# EAGLE design v2.1 (EAGLE 9.1.2)
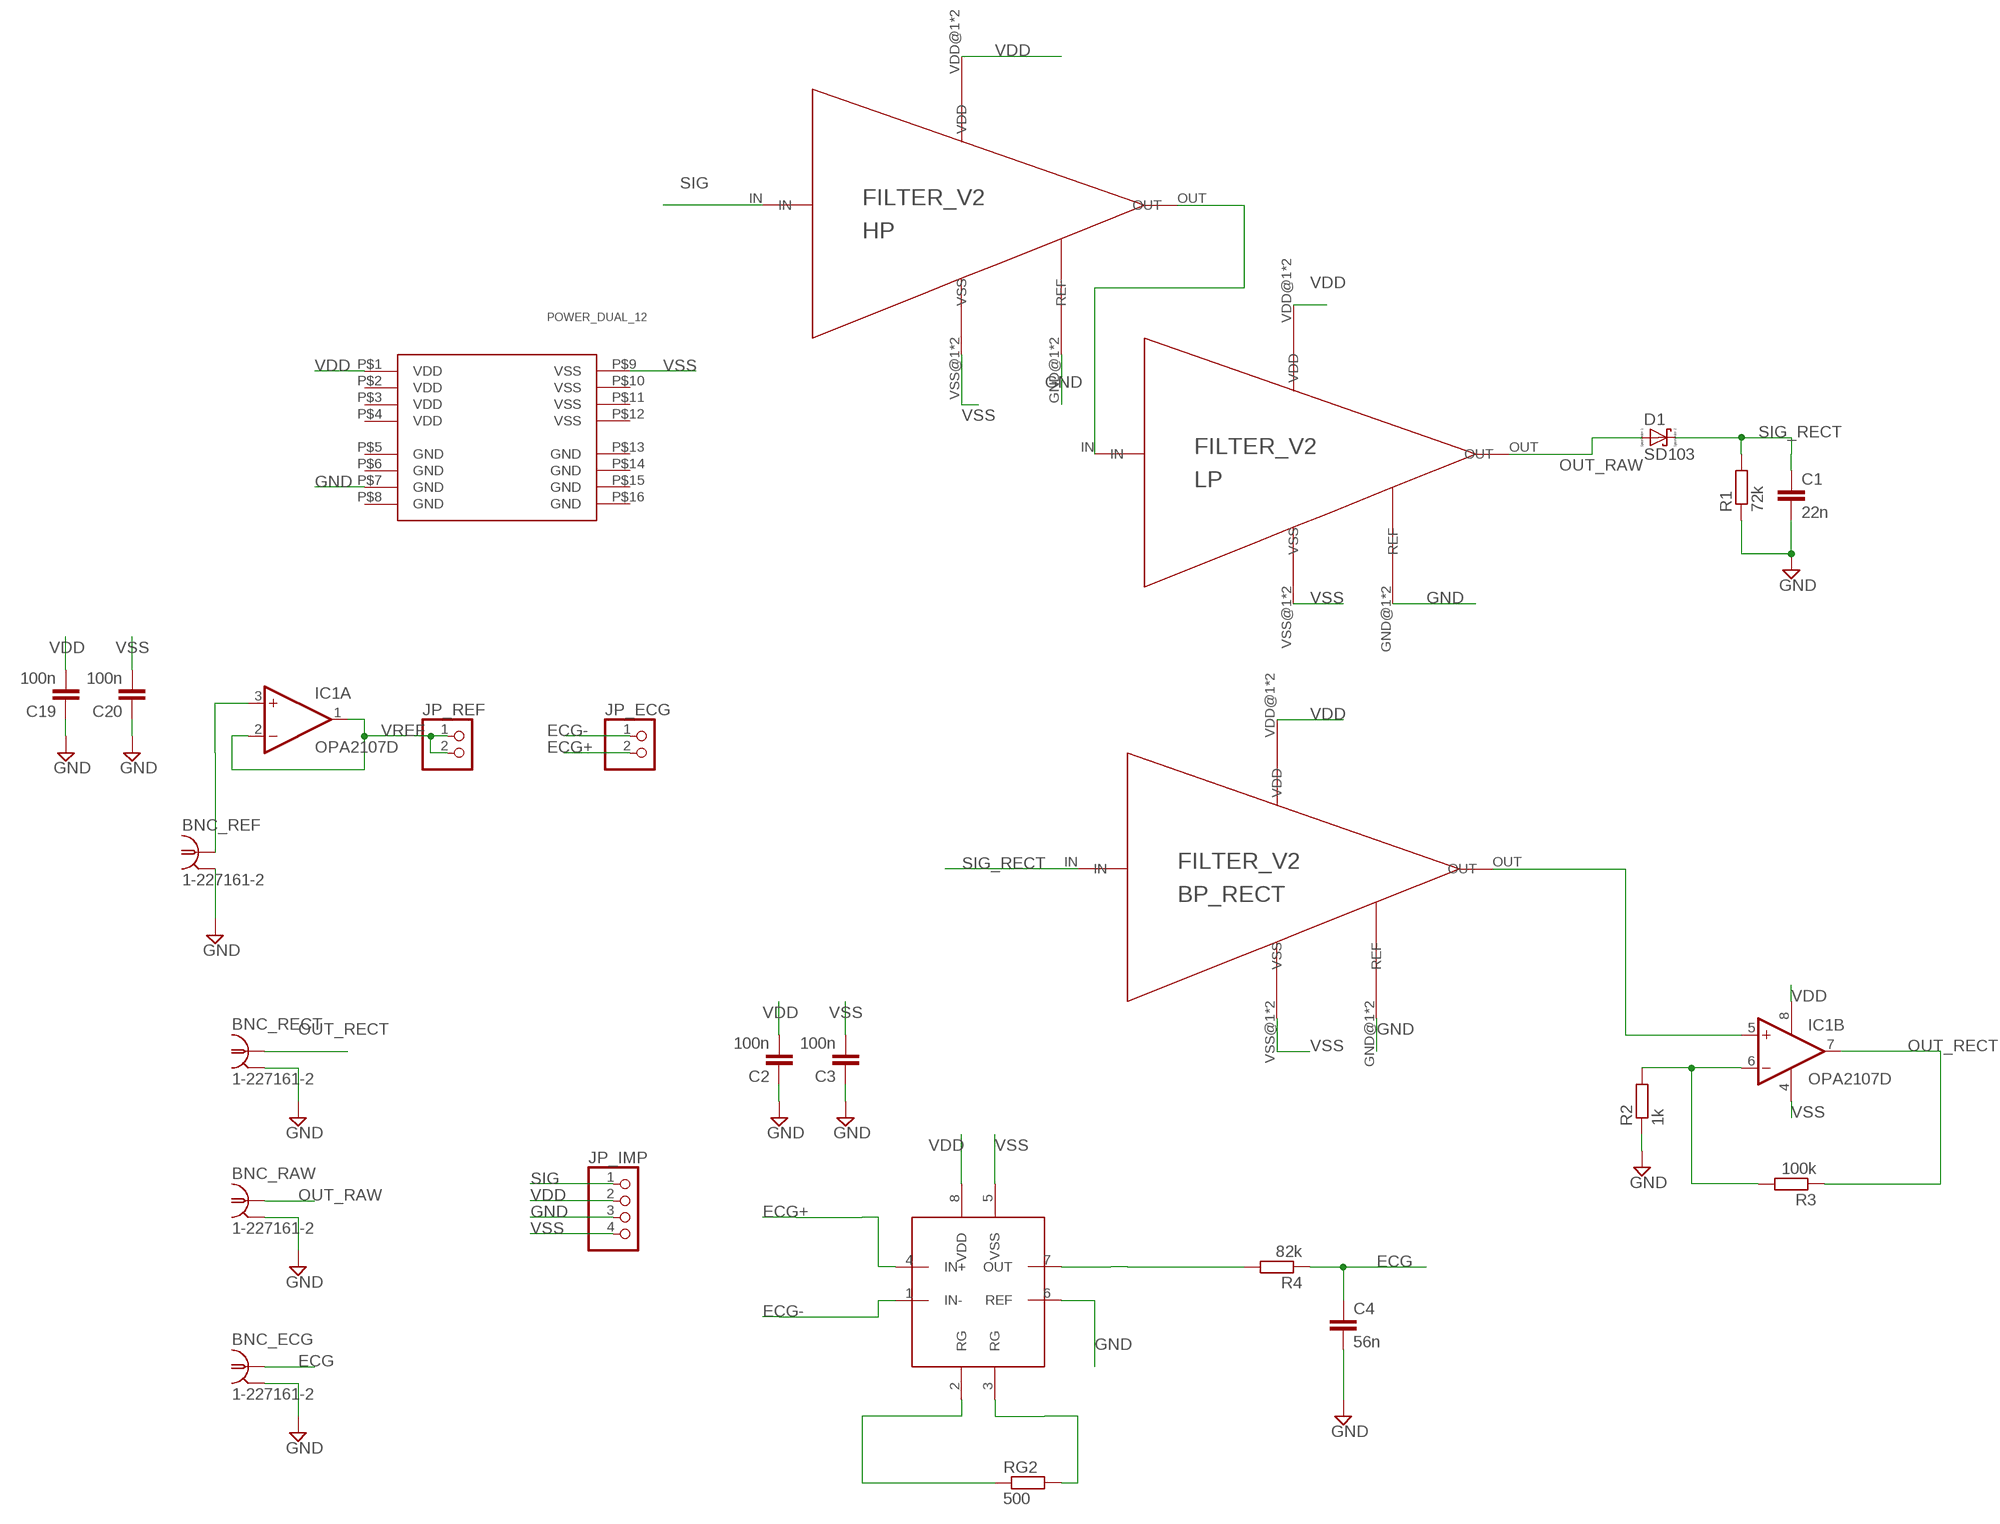
[diagram p0: schematic, sheet 1]

## Parts
BNC_ECG  1-227161-2  [AMP_227161]
BNC_RAW  1-227161-2  [AMP_227161]
BNC_RECT  1-227161-2  [AMP_227161]
BNC_REF  1-227161-2  [AMP_227161]
BP_RECT  FILTER_V2  [MODULE_FILTER_V2]
C1  22n  C-EUC0805  [C0805]
C2  100n  C-EUC0805  [C0805]
C3  100n  C-EUC0805  [C0805]
C4  56n  C-EUC0805  [C0805]
C19  100n  C-EUC0805  [C0805]
C20  100n  C-EUC0805  [C0805]
D1  SD103  SCHOTTKY-DIODE  [DIODE_SMB]
HP  FILTER_V2  [MODULE_FILTER_V2]
IC1  OPA2107D  [SO08]
INA  AD8429  [SO8]
JP_ECG  PINHD-1X2  [1X02]
JP_IMP  PINHD-1X4  [1X04]
JP_REF  PINHD-1X2  [1X02]
LP  FILTER_V2  [MODULE_FILTER_V2]
R1  72k  R-EU_R0805  [R0805]
R2  1k  R-EU_R0805  [R0805]
R3  100k  R-EU_R0805  [R0805]
R4  82k  R-EU_R0805  [R0805]
RG2  500  R-EU_R0805  [R0805]
U$1  POWER_DUAL_12  [MODULE_4X8]

## Nets
ECG: BNC_ECG.1 C4.1 R4.1
ECG+: INA.4(IN+) JP_ECG.2
ECG-: INA.1(IN-) JP_ECG.1
GND: BNC_ECG.2 BNC_RAW.2 BNC_RECT.2 BNC_REF.2 BP_RECT.GND@1(REF) BP_RECT.GND@2(REF) C1.2 C2.1 C3.1 C4.2 C19.1 C20.1 HP.GND@1(REF) HP.GND@2(REF) INA.6(REF) JP_IMP.3 LP.GND@1(REF) LP.GND@2(REF) R1.1 R2.1 U$1.P$7(GND)
N$1: IC1.6(B:-IN) R2.2 R3.2
N$2: BP_RECT.OUT IC1.5(B:+IN)
N$3: INA.7(OUT) R4.2
N$4: HP.OUT LP.IN
N$7: BNC_REF.1 IC1.3(A:+IN)
N$15: INA.2(RG) RG2.1
N$16: INA.3(RG) RG2.2
OUT_RAW: BNC_RAW.1 D1.A(C) LP.OUT
OUT_RECT: BNC_RECT.1 IC1.7(B:OUT) R3.1
SIG: HP.IN JP_IMP.1
SIG_RECT: BP_RECT.IN C1.1 D1.C(A) R1.2
VDD: BP_RECT.VDD@1(VDD) BP_RECT.VDD@2(VDD) C2.2 C19.2 HP.VDD@1(VDD) HP.VDD@2(VDD) IC1.8(P:V+) INA.8(VDD) JP_IMP.2 LP.VDD@1(VDD) LP.VDD@2(VDD) U$1.P$1(VDD)
VREF: IC1.1(A:OUT) IC1.2(A:-IN) JP_REF.1 JP_REF.2
VSS: BP_RECT.VSS@1(VSS) BP_RECT.VSS@2(VSS) C3.2 C20.2 HP.VSS@1(VSS) HP.VSS@2(VSS) IC1.4(P:V-) INA.5(VSS) JP_IMP.4 LP.VSS@1(VSS) LP.VSS@2(VSS) U$1.P$9(VSS)
Unconnected: U$1.P$2(VDD) U$1.P$3(VDD) U$1.P$4(VDD) U$1.P$5(GND) U$1.P$6(GND) U$1.P$8(GND) U$1.P$10(VSS) U$1.P$11(VSS) U$1.P$12(VSS) U$1.P$13(GND) U$1.P$14(GND) U$1.P$15(GND) U$1.P$16(GND)

## Library data of the parts
BNC_ECG BNC_RAW BNC_RECT BNC_REF = con-coax:?227161*: JACK, RIGHT ANGLE, 50 OHM, PCB, BNC Source: amp_227161.pdf; OC_FARNELL: unknown; OC_NEWARK: unknown
BP_RECT HP LP = uguz_cEGG:FILTER_V2
C1 C4 = rcl:C-EU: CAPACITOR, European symbol; SPICEPREFIX: C
C2 C3 C19 C20 = resistor:C-EU: CAPACITOR, European symbol
D1 = eagle-ltspice:SCHOTTKY-DIODE: Schottky Diode; SPICEMODEL: NONE; SPICEPREFIX: D; SPICETYPE: diode
IC1 = linear:OPA2107: OP AMP
INA = uguz_cEGG:AD8429: AD8429 Low Noise Instrumentation Amplifier https://www.mouser.de/datasheet/2/609/AD8429-1502266.pdf
JP_ECG JP_REF = pinhead:PINHD-1X2: PIN HEADER
JP_IMP = pinhead:PINHD-1X4: PIN HEADER
R1-R4 RG2 = rcl:R-EU_: RESISTOR, European symbol; SPICEPREFIX: R
U$1 = uguz_cEGG:POWER_DUAL_12

## Board
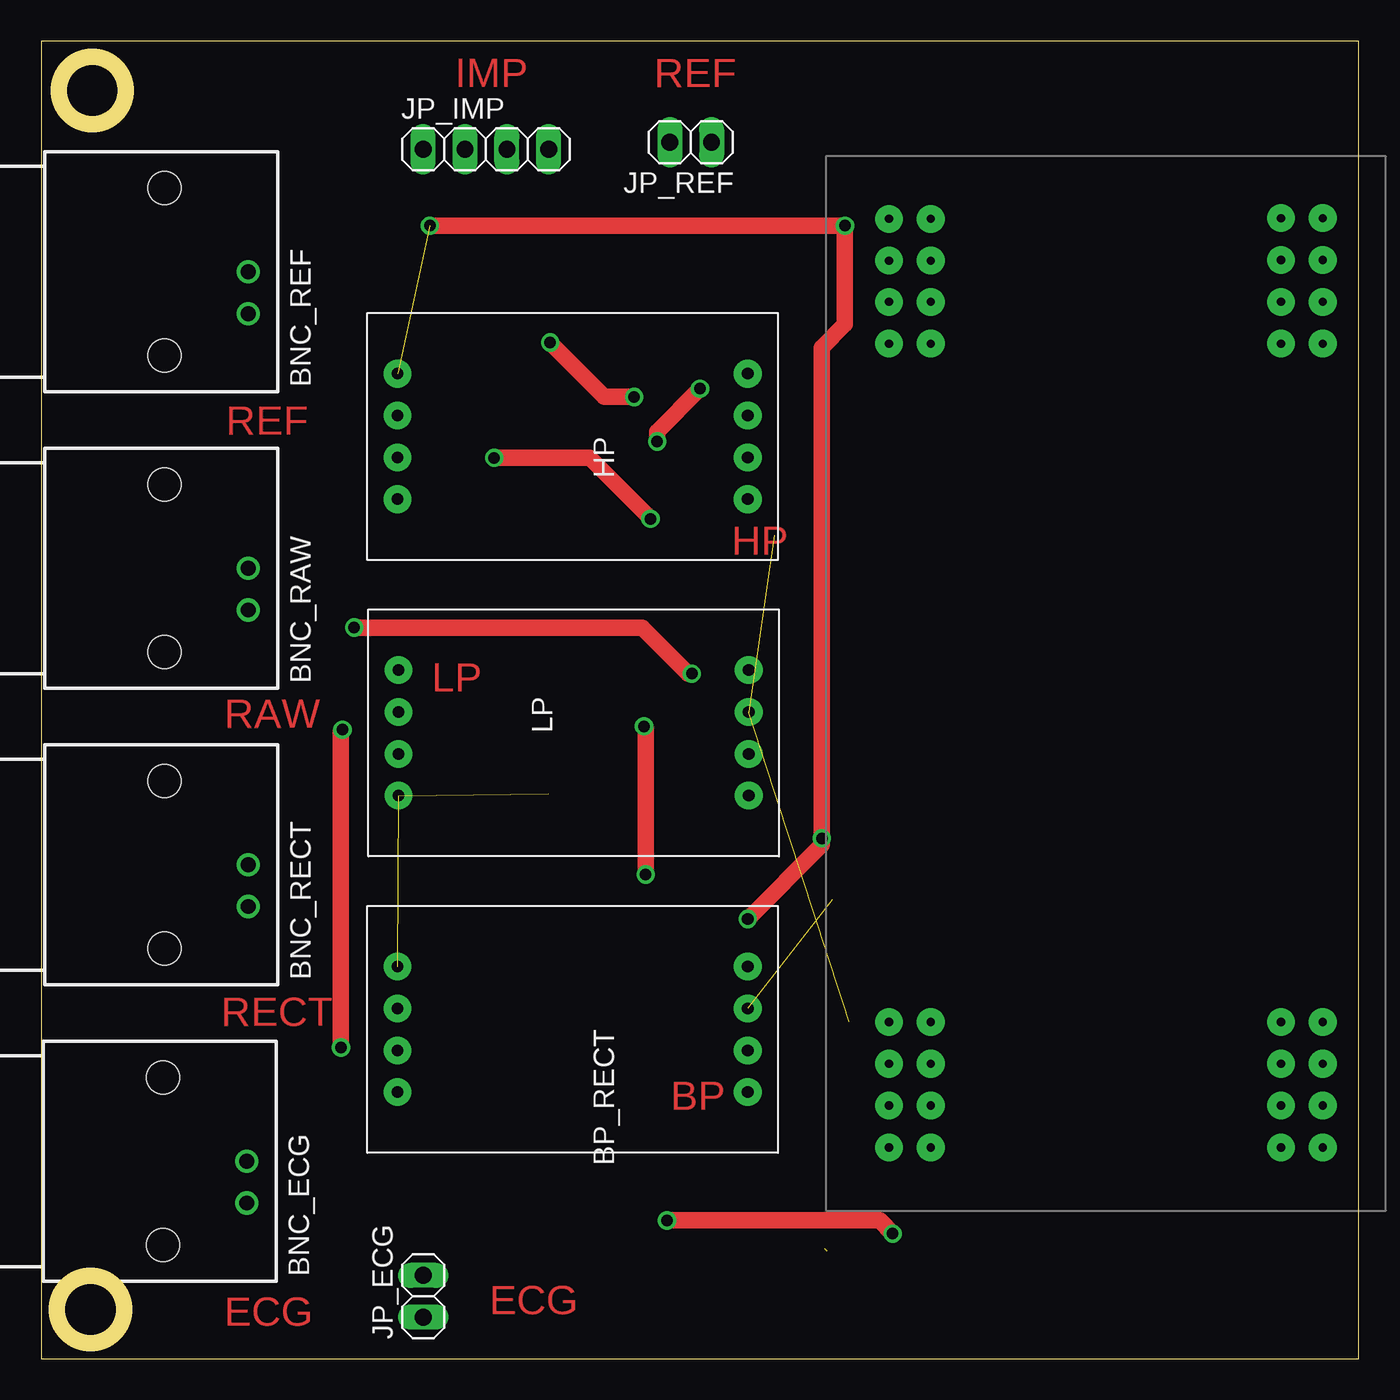
[diagram p1: board, top side]
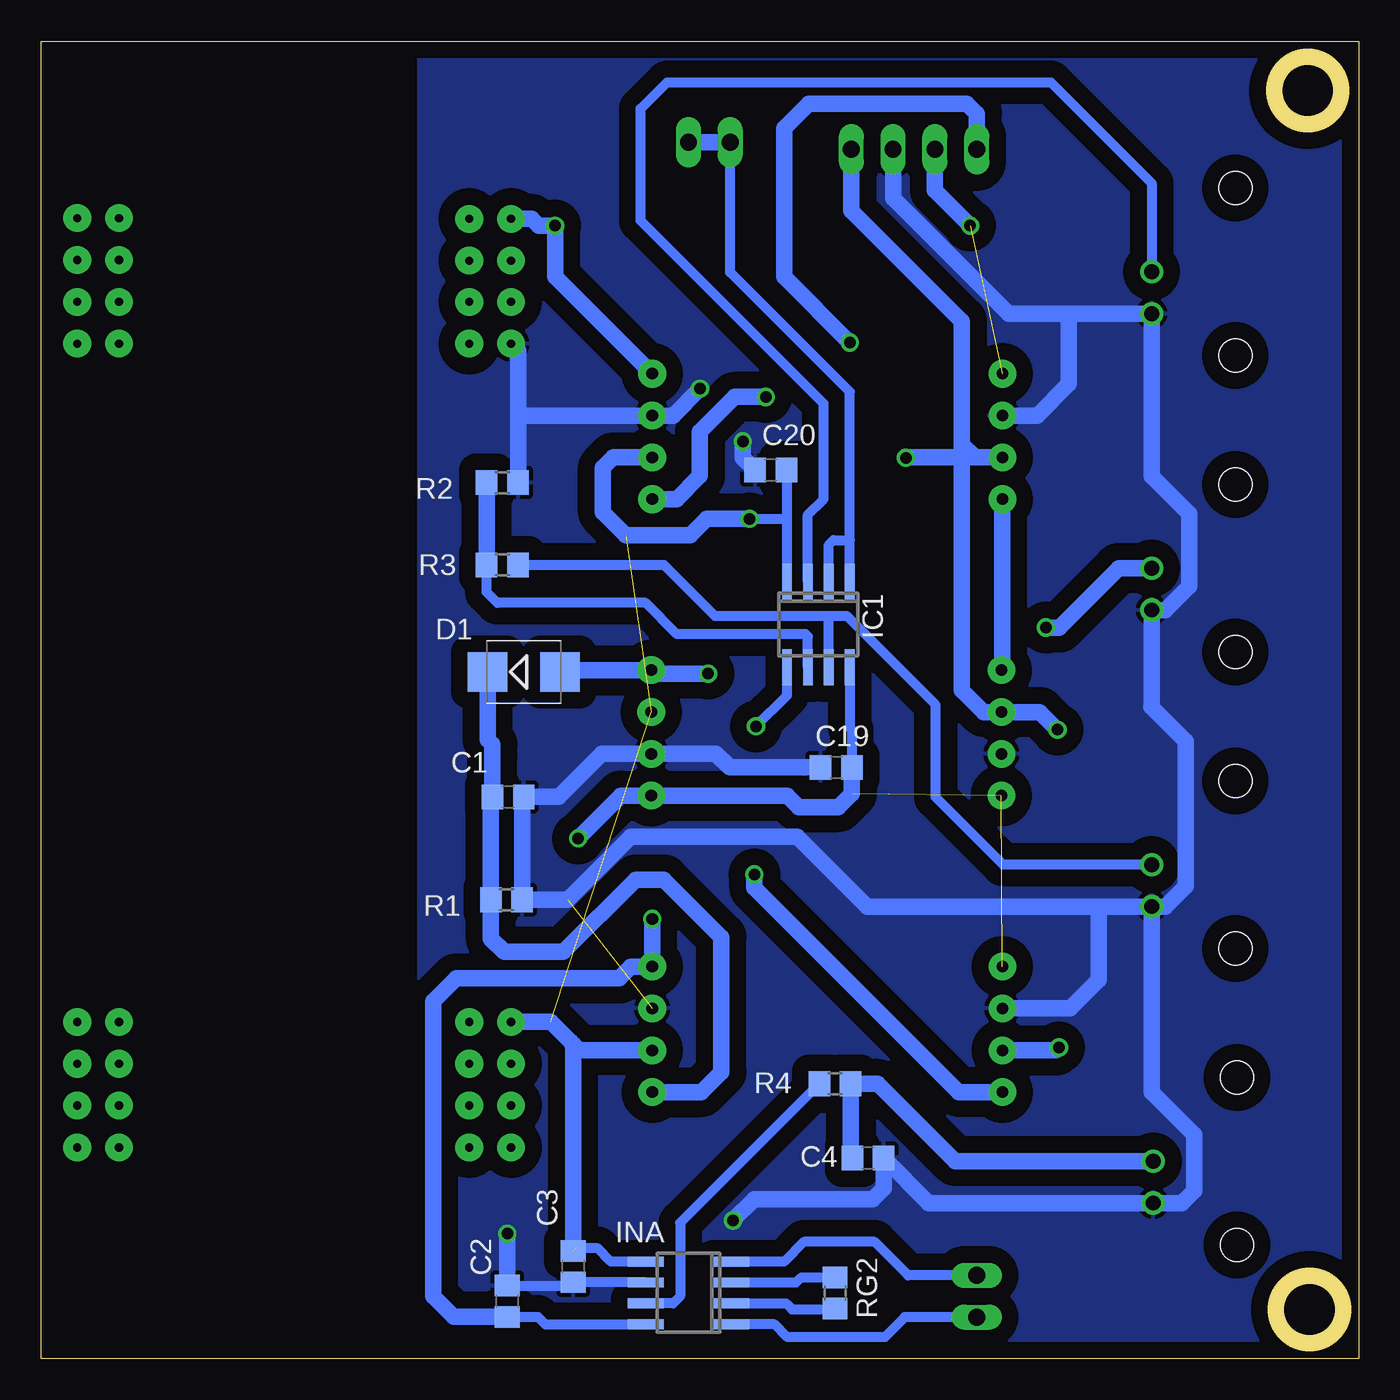
[diagram p2: board, bottom side, seen from below]

Size 80 x 80 mm. Coordinates in mm from the lower left corner, seen from the top.
Outline: 0,0 80,0 80,80 0,80 0,0
Outline: circle at 3,3 radius 2.02
Outline: circle at 3.1,77 radius 2.02
Copper layers (1*16): Top 0.035mm / dielectric 1.5mm / Bottom 0.035mm
Design rules "TM_medit_aetzen": minimum track width 10mil, minimum drill 8mil, track to track 10mil, track to pad 10mil, pad to pad 10mil, via to via 15mil, smd to smd 8mil, copper to edge 40mil, drill to drill 8mil, minimum pad ring 10mil, minimum via ring 8mil, stop-mask expansion 4mil, vias tented up to drill 0mil, thermal gap 10mil

### Footprints (pad centres in the part's own frame; a part is rotated, then mirrored left to right if it is on the bottom)
AMP_227161 = drill 0.9 pad 1.27: 1 0,-5.08; 2 -2.54,-5.08 | hole 2: -5.08,0; 5.08,0
MODULE_FILTER_V2 = drill 0.7 pad 1.676: GND@1 -1.27,11.9; GND@2 -1.27,-9.36; IN 3.81,11.9; OUT 3.81,-9.36; VDD@1 -3.81,11.9; VDD@2 -3.81,-9.36; VSS@1 1.27,11.9; VSS@2 1.27,-9.36
C0805 = smd 1.3 x 1.5: 1 -0.95,0; 2 0.95,0
DIODE_SMB = smd 2.4 x 2.4: A 2.2,0; C -2.2,0
SO08 = smd 0.6 x 2.2: 1 -1.905,-2.6; 2 -0.635,-2.6; 3 0.635,-2.6; 4 1.905,-2.6; 5 1.905,2.6; 6 0.635,2.6; 7 -0.635,2.6; 8 -1.905,2.6
SO8 = smd 0.6 x 2.2: 1 -1.905,-2.6; 2 -0.635,-2.6; 3 0.635,-2.6; 4 1.905,-2.6; 5 1.905,2.6; 6 0.635,2.6; 7 -0.635,2.6; 8 -1.905,2.6
1X02 = drill 1.016 long: 1 -1.27,0; 2 1.27,0
1X04 = drill 1.016 long: 1 -3.81,0; 2 -1.27,0; 3 1.27,0; 4 3.81,0
R0805 = smd 1.3 x 1.5: 1 -0.95,0; 2 0.95,0
MODULE_4X8 = drill 0.5 pad 1.676: P$1 -28.21,-13.17; P$2 -28.21,-10.63; P$3 -25.67,-13.17; P$4 -25.67,-10.63; P$5 -23.17,-13.17; P$6 -23.17,-10.63; P$7 -20.63,-13.17; P$8 -20.63,-10.63; P$9 20.55,-13.17; P$10 20.55,-10.63; P$11 23.09,-13.17; P$12 23.09,-10.63; P$13 25.63,-13.17; P$14 25.63,-10.63; P$15 28.17,-13.17; P$16 28.17,-10.63; P$17 -28.25,10.63; P$18 -28.25,13.17; P$19 -25.71,10.63; P$20 -25.71,13.17; P$21 -23.17,10.63; P$22 -23.17,13.17; P$23 -20.63,10.63; P$24 -20.63,13.17; P$25 20.55,10.63; P$26 20.55,13.17; P$27 23.09,10.63; P$28 23.09,13.17; P$29 25.63,10.63; P$30 25.63,13.17; P$31 28.17,10.63; P$32 28.17,13.17

### Placement (x,y rotation side)
BNC_ECG  7.4,12 90 top
BNC_RAW  7.5,48 90 top
BNC_RECT  7.5,30 90 top
BNC_REF  7.5,66 90 top
BP_RECT  31,20 270 top
C1  51.65,34.11 0 bottom
C2  51.7,3.5 270 bottom
C3  47.7,5.6 90 bottom
C4  29.8,12.2 0 bottom
C19  31.73,35.91 0 bottom
C20  35.71,53.97 0 bottom
D1  50.7,41.7 0 bottom
HP  31,56 270 top
IC1  32.81,44.59 180 bottom
INA  40.7,4 90 bottom
JP_ECG  23.2,3.8 90 top
JP_IMP  27,73.44 0 top
JP_REF  39.44,73.86 180 top
LP  33.6,38 90 top
R1  51.75,27.87 180 bottom
R2  52,53.2 180 bottom
R3  52,48.2 180 bottom
R4  31.8,16.7 180 bottom
RG2  31.8,4 90 bottom
U$1  64.64,41.01 270 top

### Tracks (layer width: path | path; a pad name or v marks a point on that pad's centre or on a via)
ECG
  Bottom 1.016: C4.1 30.85,12.3 R4.1 29.2,16.7 24.5,12 BNC_ECG.1
ECG+
  Bottom 0.61: JP_ECG.2 27.37,5.07 29.4,7.1 33.7,7.1 34.9,5.91 INA.4
ECG-
  Bottom 0.61: JP_ECG.1 27.57,2.53 28.78,1.32 34.7,1.32 35.47,2.1 INA.1
GND  (via drill 0.7)  (1 unrouted)
  Top 1.016: v37.4,55.7 37.4,56.3 v40,58.9 | v51.7,7.6 50.9,8.4 v38,8.4
  Bottom 0.61: INA.6 47.69,4.63 | 47.69,4.63 C3.1 | C2.1 47.87,4.45 47.69,4.63
  Bottom 1.016: C19.1 38.21,35.91 39.03,36.73 LP.GND@2 45.97,36.73 48.59,34.11 C1.2 50.8,34.02 R1.1 48.03,27.87 44.2,31.7 34.1,31.7 29.86,27.46 15.8,27.46 | R2.1 51.05,57.4 | 51.05,57.4 51.05,61.21 U$1.P$7 | BNC_RECT.2 15.8,27.46 | BNC_RECT.2 11.74,27.46 10.5,28.7 10.5,37.5 12.6,39.6 12.58,39.62 BNC_RAW.2 11.74,45.46 10.3,46.9 10.3,51.3 12.58,53.58 BNC_REF.2 17.6,63.46 | 17.6,63.46 21.26,63.46 28.27,70.47 JP_IMP.3 | HP.GND@2 19.53,57.27 17.6,59.2 17.6,63.46 | BP_RECT.GND@2 17.53,21.27 15.8,23 15.8,27.46 | 51.05,57.4 50.92,57.27 HP.GND@1 41.63,57.27 v40,58.9 | C20.1 37.4,54.71 v37.4,55.7 | BNC_RECT.2 12.58,16.18 10,13.6 10,10.2 10.74,9.46 BNC_ECG.2 26.11,9.46 C4.2 28.85,10.35 29.5,9.7 36.7,9.7 v38,8.4 | C2.1 v51.7,7.6
  pour Bottom (isolate 1.016): 0,80 0,0 17,0 57.1,0 57.1,80
N$1
  Bottom 0.61: IC1.6 33.45,43.84 33.6,44 41.4,44 43.3,45.9 52.3,45.9 52.95,46.55 R3.2
  Bottom 1.016: R3.2 R2.2
N$2  (via drill 0.7)
  Top 1.016: v36.7,29.4 36.7,38.3 v36.6,38.4
  Bottom 0.61: v36.6,38.4 34.72,40.28 IC1.5
  Bottom 1.016: BP_RECT.OUT 24.29,16.19 36.7,28.6 v36.7,29.4
N$3
  Bottom 0.61: R4.2 41.2,8.25 41.2,3.8 41.63,3.37 INA.7
N$4
  Bottom 1.016: LP.IN 21.64,41.87 HP.OUT
N$7
  Bottom 0.61: IC1.3 33.45,51.26 32.5,52.2 32.5,58 43.6,69.1 43.6,75.9 42,77.5 18.7,77.5 12.58,71.38 BNC_REF.1
N$15
  Bottom 0.61: INA.2 34.77,3.37 34.4,3 31.85,3 RG2.1
N$16
  Bottom 0.61: INA.3 34.16,4.63 33.85,4.95 RG2.2
OUT_RAW  (via drill 0.7)
  Top 1.016: v19,44.4 36.5,44.4 39.3,41.6 v39.5,41.6
  Bottom 1.016: D1.A 48.39,41.81 LP.OUT 42.75,41.6 v39.5,41.6 | v19,44.4 18.18,44.4 14.58,48 BNC_RAW.1
OUT_RECT
  Bottom 0.61: R3.1 42.2,48.2 39.1,45.1 32.1,45.1 | 32.1,45.1 31.1,45.1 25.7,39.7 25.7,34.1 21.6,30 BNC_RECT.1 | IC1.7 32.17,45.02 32.1,45.1
SIG  (via drill 0.7)
  Top 1.016: v30.9,61.7 34.2,58.4 v36,58.4
  Bottom 1.016: JP_IMP.1 23.19,75.59 23.8,76.2 33.4,76.2 34.9,74.7 34.9,65.7 v30.9,61.7 | v36,58.4 37.9,58.4 40,56.3 40,53.6 41.41,52.19 HP.IN
SIG_RECT
  Bottom 1.016: D1.C 52.9,37.6 52.6,37.3 52.6,36.6 C1.1 52.7,34.02 R1.2 52.7,25.5 51.9,24.7 48.3,24.7 43.9,29.1 42.2,29.1 38.7,25.6 38.7,17.4 39.91,16.19 BP_RECT.IN
VDD  (via drill 0.7)  (3 unrouted)
  Top 1.016: v23.6,68.8 v48.8,68.8 48.8,62.8 47.4,61.4 v47.4,31.6 47.4,31.2 v42.9,26.7
  Bottom 0.61: IC1.8 30.91,38.3 30.78,38.18 C19.2 | C2.2 49.85,2.55 49.4,2.1 INA.8
  Bottom 1.016: C19.2 30.78,34.32 31.6,33.5 34,33.5 34.69,34.19 LP.VDD@2 44.81,34.19 v47.4,31.6 | JP_IMP.2 25.73,70.93 v23.6,68.8 | U$1.P$1 50.22,69.22 49.8,68.8 v48.8,68.8 48.8,65.71 HP.VDD@1 | v42.9,26.7 BP_RECT.VDD@1 44.19,23.81 44.9,23.1 54.8,23.1 56.2,21.7 56.2,3.8 54.95,2.55 C2.2
VREF
  Bottom 0.61: IC1.1 30.91,49.7 | 30.91,49.7 30.91,58.7 38.17,65.97 JP_REF.2 | IC1.2 32.17,49.42 31.9,49.7 30.91,49.7
  Bottom 1.016: JP_REF.2 JP_REF.1
VSS  (via drill 0.7)  (3 unrouted)
  Top 1.016: v27.5,54.7 33.3,54.7 v37,51 | v18.2,18.9 18.2,38.1 v18.3,38.2
  Bottom 0.61: IC1.4 34.72,50.9 | 34.72,50.9 34.72,53.92 C20.2 | INA.5 45.41,5.91 46.2,6.7 47.55,6.7 | v37,51 34.81,51 34.72,50.9
  Bottom 1.016: JP_IMP.4 30.81,69.71 24.1,63 24.1,55.5 | 24.1,55.5 23.33,54.73 HP.VSS@2 27.47,54.73 v27.5,54.7 | 24.1,55.5 24.1,40.6 22.77,39.27 LP.VSS@1 19.37,39.27 v18.3,38.2 | BP_RECT.VSS@1 47.33,18.73 47.7,19.1 | U$1.P$9 49.05,20.45 47.85,19.25 47.7,19.1 | v37,51 39.6,51 40.6,50 44.5,50 45.9,51.4 45.9,54.1 45.27,54.73 HP.VSS@1 | BP_RECT.VSS@2 18.37,18.73 v18.2,18.9 | C3.2 47.7,19.1

### Text on the board
Top: IMP | REF | REF | HP | LP | RAW | RECT | BP | ECG | ECG